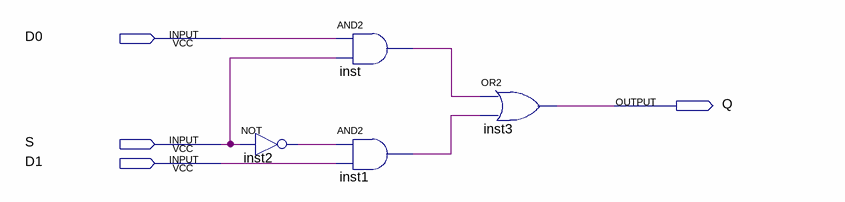
[diagram p0: schematic sheet]
// Quartus schematic MUX2.bdf as structural Verilog: 4 symbols, 4 pins
module MUX2 (
  input  D0,
  input  S,
  input  D1,
  output Q
);

  wire inst1_out, inst2_out, inst_out;

  not inst2 (inst2_out, S);
  and inst (inst_out, D0, S);
  and inst1 (inst1_out, inst2_out, D1);
  or inst3 (Q, inst_out, inst1_out);
endmodule
